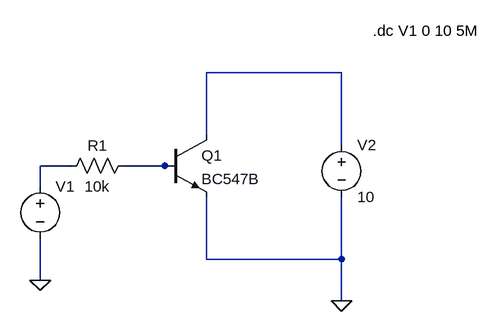
[diagram p0: schematic schemat1.asc]
schemat1.asc, the LTspice schematic file:
Version 4
SHEET 1 884 680
WIRE 544 -48 336 -48
WIRE 336 48 336 -48
WIRE 544 64 544 -48
WIRE 128 96 80 96
WIRE 272 96 208 96
WIRE 288 96 272 96
WIRE 80 128 80 96
WIRE 336 240 336 144
WIRE 544 240 544 144
WIRE 544 240 336 240
WIRE 80 272 80 208
WIRE 544 304 544 240
FLAG 80 272 0
FLAG 544 304 0
SYMBOL voltage 80 112 R0
WINDOW 123 0 0 Left 2
WINDOW 39 0 0 Left 2
SYMATTR InstName V1
SYMATTR Value ""
SYMBOL npn 272 48 R0
SYMATTR InstName Q1
SYMATTR Value BC547B
SYMBOL res 112 112 R270
WINDOW 0 32 56 VTop 2
WINDOW 3 0 56 VBottom 2
SYMATTR InstName R1
SYMATTR Value 10k
SYMBOL voltage 544 48 R0
WINDOW 123 0 0 Left 2
WINDOW 39 0 0 Left 2
SYMATTR InstName V2
SYMATTR Value 10
TEXT 592 -112 Left 2 !.dc V1 0 10 5M

The netlist it stands for:
* schemat1.asc
V1 N002 0
Q1 N001 N003 0 0 BC547B
R1 N002 N003 10k
V2 N001 0 10
.model NPN NPN
.model PNP PNP
.lib standard.bjt
.dc V1 0 10 5M
.backanno
.end